# Altium project rsx_low_power_board.PrjPcb (part 1 of 2)
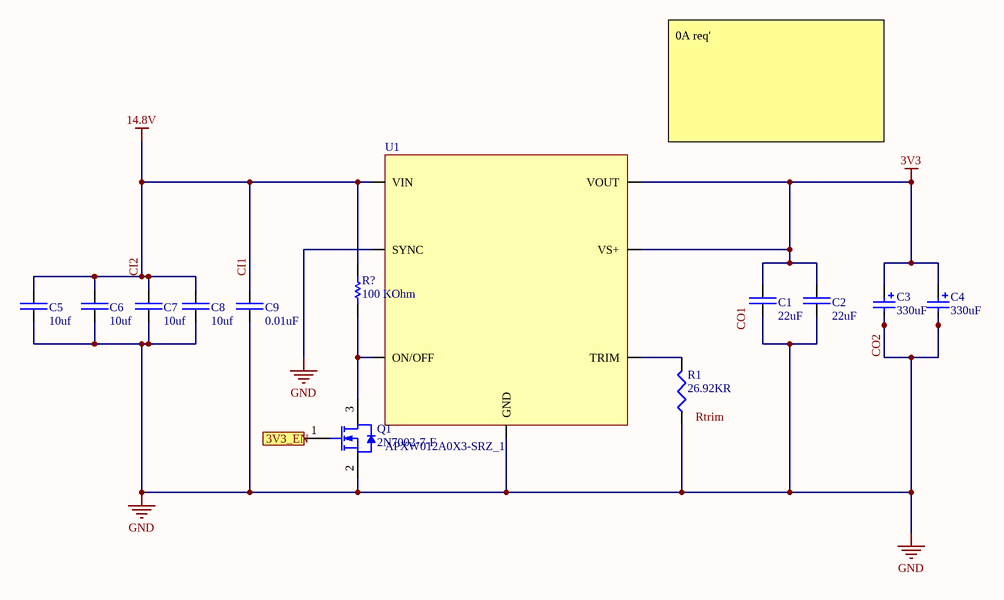
[diagram p0: rsx_low_power_board.SchDoc]
6 sheets, 69 parts. Net scope: flat (ports and power ports of the same name join across sheets).
Board file: rsx_low_power_board.PcbDoc
Sheets:
  rsx_low_power_board.SchDoc
  rsx_low_power_board_5V.SchDoc
  rsx_low_power_board_12V.SchDoc
  rsx_low_power_board_24V.SchDoc
  rsx_low_power_board In Going Connectors.SchDoc
  sch2_eFuse_5V.SchDoc

## Sheet rsx_low_power_board.SchDoc
size A4

### Parts
(Parts that share a designator on the sheet are numbered #1, #2 ... from top to bottom, then left to right.)
C1  22uF  [22uF Capacitor]
C2  22uF  [22uF Capacitor]
C3  330uF  [330uF throught hole]
C4  330uF  [330uF throught hole]
C5  10uf  [10uF capacitor LPB]
C6  10uf  [10uF capacitor LPB]
C7  10uf  [10uF capacitor LPB]
C8  10uf  [10uF capacitor LPB]
C9  0.01uF  [0.01uF capacitor]
Q1#1  2N7002-7-F  [DIOD-SOT23-3_V]
R1#1  26.92KR  [26.7KR Resistor]
R?#1  100 KOhm  [RESC1609X55X30ML10T20]
U1  APXW012A0X3-SRZ_1  [DC-DC Buck converter]

### Ports
3V3_EN (in)

### Nets
3V3: C1.2 C2.2 C3.1 C4.1 U1.3(VS+) U1.5(VOUT)
CI1: C5.2 C6.2 C7.2 C8.2 C9.2 R?#1.2 U1.7(VIN)  [also labelled 14.8V, CI2]
CO2: C1.1 C2.1 C3.2 C4.2 C5.1 C6.1 C7.1 C8.1 C9.1 Q1#1.2(S) R1#1.1 U1.2(GND) U1.6(SYNC)  [also labelled GND]
NetQ1#1_1: Q1#1.1(G) ; port 3V3_EN
NetQ1#1_3: Q1#1.3(D) R?#1.1 U1.1(ON/OFF)
NetR1#1_2: R1#1.2 U1.4(TRIM)

### Notes on the sheet
- 0A req'
- Labels drawn without touching a wire or pin: CO1, Rtrim

### Library data of the parts
C1 C2 = GRM32ER71E226KE15L: Cap Ceramic 22uF 25V X7R 10% SMD 1210 125C Embossed T/R; Manufacturer 1: Murata; Supplier 1: Digi-Key; Supplier Part Number 1: 490-5313-6-ND; Manufacturer Part Number 1: GRM32ER71E226KE15L; Stock 1: 52660; Pricing 1: 1=1,78000, 10=1,40600, 100=1,05410, 500=0,79646 (USD); RoHS: Yes; Mount: Surface Mount; Case/Package: 1210; Number of Pins: 2; Case Code (Metric): 3225; Case Code (Imperial): 1210; Material: Ceramic; Min Operating Temperature: -55°C; Max Operating Temperature: 125°C; Capacitance: 22uF; Tolerance: 10%; Dielectric: X7R; Voltage Rating: 25V; Packaging: Tape and Reel; Package Quantity: 1; Voltage Rating (DC): 25V; Termination: SMD/SMT; Voltage: 25V; Length: 3.2mm; Height: 2.5mm; Width: 0.098inch; Thickness: 0.106inch; Depth: 2.5mm; Radiation Hardening: No; REACH SVHC: No SVHC; Lead Free: Lead Free; ComponentLink1URL: https://datasheet.ciiva.com/6072/1697714-6072768.pdf?src-supplier=Farnell; ComponentLink1Description: https://datasheet.ciiva.com/6072/1697714-6072768.pdf?src-supplier=Farnell; ComponentLink2URL: https://datasheet.ciiva.com/16497/product-16497009.pdf?src-supplier=Future+Electronics; ComponentLink2Description: https://datasheet.ciiva.com/16497/product-16497009.pdf?src-supplier=Future+Electronics; ComponentLink3URL: https://datasheet.ciiva.com/3776/2741grm32er71e226ke1523-3776996.pdf?src-supplier=Arrow; ComponentLink3Description: https://datasheet.ciiva.com/3776/2741grm32er71e226ke1523-3776996.pdf?src-supplier=Arrow; ComponentLink4URL: https://datasheet.ciiva.com/11789/0900766b80ef921d-11789129.pdf?src-supplier=RSComponents; ComponentLink4Description: https://datasheet.ciiva.com/11789/0900766b80ef921d-11789129.pdf?src-supplier=RSComponents; ComponentLink5URL: https://datasheet.ciiva.com/29201/451826-da-01-de-vs-kondens-grm32-er71e-226ke15l-29201795.pdf?src-supplier=Conrad; ComponentLink5Description: https://datasheet.ciiva.com/29201/451826-da-01-de-vs-kondens-grm32-er71e-226ke15l-29201795.pdf?src-supplier=Conrad; ComponentLink6URL: https://datasheet.ciiva.com/175/partnumbering-e-01-175746.pdf?src-supplier=Digi-Key; ComponentLink6Description: https://datasheet.ciiva.com/175/partnumbering-e-01-175746.pdf?src-supplier=Digi-Key; ComponentLink7URL: https://datasheet.ciiva.com/175/partnumbering-e-01-175747.pdf?src-supplier=Digi-Key; ComponentLink7Description: https://datasheet.ciiva.com/175/partnumbering-e-01-175747.pdf?src-supplier=Digi-Key; ComponentLink8URL: https://datasheet.ciiva.com/175/partnumbering-e-01-175748.pdf?src-supplier=Digi-Key; ComponentLink8Description: https://datasheet.ciiva.com/175/partnumbering-e-01-175748.pdf?src-supplier=Digi-Key; ComponentLink9URL: https://datasheet.ciiva.com/22703/1697714-22703397.pdf?src-supplier=Element14; ComponentLink9Description: https://datasheet.ciiva.com/22703/1697714-22703397.pdf?src-supplier=Element14; Category: Capacitor
C3 C4 = 35ZLH330MEFCT810X12.5: CAP ALUM 330UF 20% 35V RADIAL; Manufacturer 1: Rubycon; Ripple Current: 731.5mA; Impedance: 39mR; Life (Hours): 10000Hour; Supplier 1: Digi-Key; Supplier Part Number 1: 1189-3752-1-ND; Manufacturer Part Number 1: 35ZLH330MEFCT810X12.5; Stock 1: 14330; Pricing 1: 1=0,52000, 10=0,36900, 100=0,24280 (USD); RoHS: Yes; Mount: Through Hole; Case/Package: Radial; Min Operating Temperature: -40°C; Max Operating Temperature: 105°C; Package Quantity: 1000; Capacitance: 330uF; Packaging: Tape and Reel; Tolerance: 20%; Voltage Rating: 35V; Lead Pitch: 0.197inch; Height - Seated (Max): 0.551inch; ComponentLink1URL: http://www.rubycon.co.jp/en/catalog/e_pdfs/aluminum/e_ZLH.pdf?src-supplier=Digi-Key; ComponentLink1Description: http://www.rubycon.co.jp/en/catalog/e_pdfs/aluminum/e_ZLH.pdf?src-supplier=Digi-Key; ComponentLink2URL: http://www.rubycon.co.jp/en/catalog/e_pdfs/aluminum/Radial_Lead_Alumi_Eng.pdf?src-supplier=Digi-Key; ComponentLink2Description: http://www.rubycon.co.jp/en/catalog/e_pdfs/aluminum/Radial_Lead_Alumi_Eng.pdf?src-supplier=Digi-Key
C5-C8 = GRT31CR61H106ME01L: CAP CER 10UF 50V X5R 1206; Manufacturer 1: Murata; Tolerance: 20%; Supplier 1: Digi-Key; Supplier Part Number 1: 490-12457-1-ND; Manufacturer Part Number 1: GRT31CR61H106ME01L; Stock 1: 8159; Pricing 1: 1=0,50000, 10=0,34900, 100=0,20920, 500=0,15690, 1000=0,13249 (USD); RoHS: Yes; Mount: Surface Mount; Case/Package: 1206; Case Code (Metric): 3216; Case Code (Imperial): 1206; Min Operating Temperature: -55°C; Max Operating Temperature: 85°C; Packaging: Tape and Reel; Capacitance: 10uF; Voltage Rating: 50V; Length: 0.126inch; Width: 0.063inch; Thickness: 0.071inch; Ratings: AEC-Q200; ComponentLink1URL: http://search.murata.co.jp/Ceramy/image/img/A01X/G101/ENG/GRT31CR61H106ME01-01.pdf?src-supplier=Digi-Key; ComponentLink1Description: http://search.murata.co.jp/Ceramy/image/img/A01X/G101/ENG/GRT31CR61H106ME01-01.pdf?src-supplier=Digi-Key; Category: Capacitor
C9 = C0603C103KARACAUTO: Cap Ceramic 0.01uF 250V X7R 10% Pad SMD 0603 125C Automotive T/R; Manufacturer 1: KEMET; Capacitance: 10nF; Supplier 1: Digi-Key; Supplier Part Number 1: 399-17960-1-ND; Manufacturer Part Number 1: C0603C103KARACAUTO; Stock 1: 8483; Pricing 1: 1=0,90000, 10=0,68500, 100=0,49040, 500=0,37964, 1000=0,32691 (USD); RoHS: No; Mount: Surface Mount; Case/Package: 0603; Case Code (Imperial): 0603; Case Code (Metric): 1608; Min Operating Temperature: -55°C; Max Operating Temperature: 125°C; Packaging: Tape and Reel; Tolerance: 10%; Voltage Rating: 250V; Ratings: AEC-Q200; ComponentLink1URL: https://api.kemet.com/component-edge/download/datasheet/C0603C103KARACAUTO.pdf?src-supplier=Digi-Key; ComponentLink1Description: https://api.kemet.com/component-edge/download/datasheet/C0603C103KARACAUTO.pdf?src-supplier=Digi-Key; Category: Capacitor
Q1#1 = CMP-2000-04929-1: N-Channel Enhancement Mode Field Effect Transistor, 60 V, 0.115 A, -55 to 150 degC, 3-Pin SOT23, RoHS, Tape and Reel; Id - Continuous Drain Current: 115mA; Typical Turn-On Delay Time: 7ns; Typical Turn-Off Delay Time: 11ns; Brand: DiodesIncorporated; Transistor Type: 1N-Channel; Vgs - Gate-Source Voltage: 20V; Rise Time: 3ns; Configuration: Single; Fall Time: 5.6ns; Vds - Drain-Source Breakdown Voltage: 70V; Rds On - Drain-Source Resistance: 7.5Ohms; Number of Channels: 1Channel; Forward Transconductance - Min: 0.08S; Pd - Power Dissipation: 300mW; Unit Weight: 0.000282oz; Datasheet URL: http://datasheet.octopart.com/2N7002-7-F-Diodes-Inc.-datasheet-8326113.pdf; Width: 1.3mm; Series: 2N7002; Length: 2.9mm; Product Category: MOSFET; Minimum Operating Temperature: -55C; Manufacturer URL: http://www.diodes.com/; Mounting Style: SMD/SMT; Package Reference: SOT23-3; Package Description: 3-Pin Small Outline Transistor, Body 2.9 x 1.3 mm, Pitch 0.96 mm; Maximum Operating Temperature: +150C; Transistor Polarity: N-Channel; Factory Pack Quantity: 3000; Technology: Si; Channel Mode: Enhancement; Datasheet Version: Rev. 21-2, 02/2009; Type: EnhancementModeFieldEffectTransistor; RoHS: True; Packaging: Reel; Package / Case: SOT-23-3; Height: 1mm; Product: MOSFETSmallSignal; Manufacturer: DiodesIncorporated
R1#1 = ERA-3AEB2672V: RES SMD 26.7KOHM 0.1% 1/10W 0603; Manufacturer 1: Panasonic; Resistance: 26.7kR; Power Rating: 100mW; Voltage Rating: 75V; Temperature Coefficient: 25ppm/°C; Supplier 1: Digi-Key; Supplier Part Number 1: P26.7KDBCT-ND; Manufacturer Part Number 1: ERA-3AEB2672V; Stock 1: 17260; Pricing 1: 1=0,35000, 10=0,30000, 100=0,11720, 1000=0,04906, 2500=0,04498 (USD); RoHS: Yes; Mount: Surface Mount; Case/Package: 0603; Number of Pins: 2; Case Code (Metric): 1608; Case Code (Imperial): 0603; Contact Plating: Tin; Min Operating Temperature: -55°C; Max Operating Temperature: 155°C; Tolerance: 0.1%; Packaging: Tape and Reel; Package Quantity: 1; Composition: Thin Film,Metal Film; Number of Terminations: 2; Max Power Dissipation: 100mW; Voltage Rating (DC): 75V; Features: Automotive AEC-Q200; Length: 1.6mm; Height: 0.45mm; Width: 0.8mm; Depth: 0.8mm; Radiation Hardening: No; Lead Free: Lead Free; REACH SVHC: No SVHC; ComponentLink1URL: https://datasheet.ciiva.com/11814/0900766b80eb1d8c-11814836.pdf?src-supplier=RSComponents; ComponentLink1Description: https://datasheet.ciiva.com/11814/0900766b80eb1d8c-11814836.pdf?src-supplier=RSComponents; ComponentLink2URL: https://datasheet.ciiva.com/5987/485442-5987192.pdf?src-supplier=Farnell; ComponentLink2Description: https://datasheet.ciiva.com/5987/485442-5987192.pdf?src-supplier=Farnell; ComponentLink3URL: https://datasheet.ciiva.com/5987/485442-5987183.pdf?src-supplier=Farnell; ComponentLink3Description: https://datasheet.ciiva.com/5987/485442-5987183.pdf?src-supplier=Farnell; ComponentLink4URL: https://datasheet.ciiva.com/46422/485442-46422629.pdf?src-supplier=Element14; ComponentLink4Description: https://datasheet.ciiva.com/46422/485442-46422629.pdf?src-supplier=Element14; ComponentLink5URL: https://datasheet.ciiva.com/17210/aoa0000ce26-17210681.pdf?src-supplier=Avnet+Europe; ComponentLink5Description: https://datasheet.ciiva.com/17210/aoa0000ce26-17210681.pdf?src-supplier=Avnet+Europe
R?#1 = CMP-2000-03816-1: Part Number: CRCW06030000Z0EA; Manufacturer: Vishay Dale
U1 = APXW012A0X3-SRZ_1: DC DC CONVERTER 3-18V 12A; Manufacturer 1: GE; Number of Outputs: 1; Min Input Voltage: 9V; Max Input Voltage: 36V; Voltage - Output 1: 18V; Efficiency: 95.5%; Supplier 1: Avnet; Supplier Part Number 1: 150028492; Manufacturer Part Number 1: APXW012A0X3-SRZ; Stock 1: 0; RoHS: Yes; Mount: Surface Mount; Case/Package: Module; Number of Pins: 9; Min Operating Temperature: -40°C; Max Operating Temperature: 85°C; Packaging: Tape and Reel; Max Output Current: 12A; Current - Output 1: 12A; Package Quantity: 140; Output Current: 12A; Output Voltage: 18V; Features: OCP,OTP; Length: 1.3inch; Height: 0.39inch; Width: 0.53inch; ComponentLink1URL: http://apps.geindustrial.com/publibrary/checkout/DS-APXW012?TNR=Data%20Sheets&src-supplier=Avnet; ComponentLink1Description: http://apps.geindustrial.com/publibrary/checkout/DS-APXW012?TNR=Data%20Sheets&src-supplier=Avnet; ComponentLink2URL: http://apps.geindustrial.com/publibrary/checkout/DS-APXW012?TNR=Data%20Sheets|DS-APXW012|generic&src-supplier=Digi-Key; ComponentLink2Description: http://apps.geindustrial.com/publibrary/checkout/DS-APXW012?TNR=Data%20Sheets|DS-APXW012|generic&src-supplier=Digi-Key; ComponentLink3URL: http://apps.geindustrial.com/publibrary/checkout/DS-APXW012?TNR=Data%20Sheets%7CDS-APXW012%7Cgeneric&src-supplier=Mouser; ComponentLink3Description: http://apps.geindustrial.com/publibrary/checkout/DS-APXW012?TNR=Data%20Sheets%7CDS-APXW012%7Cgeneric&src-supplier=Mouser; Category: Buck Converter

## Sheet rsx_low_power_board_5V.SchDoc
size A4
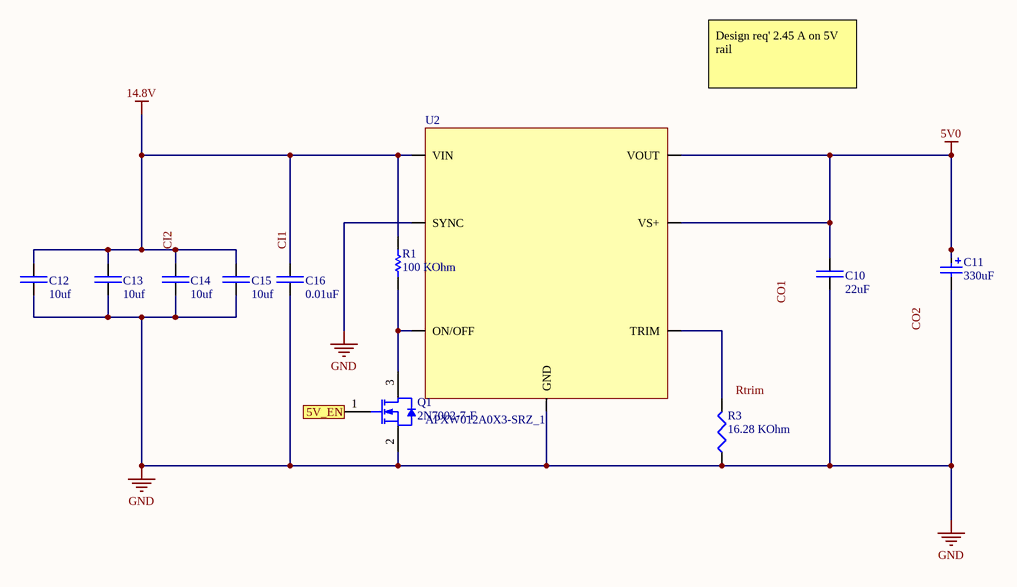
[diagram p1: rsx_low_power_board_5V.SchDoc]

### Parts
(Parts that share a designator on the sheet are numbered #1, #2 ... from top to bottom, then left to right.)
C10  22uF  [22uF Capacitor]
C11  330uF  [330uF throught hole]
C12  10uf  [10uF capacitor LPB]
C13  10uf  [10uF capacitor LPB]
C14  10uf  [10uF capacitor LPB]
C15  10uf  [10uF capacitor LPB]
C16  0.01uF  [0.01uF capacitor]
Q1#2  2N7002-7-F  [DIOD-SOT23-3_V]
R1#2  100 KOhm  [RESC1609X55X30ML10T20]
R3#1  16.28 KOhm  [16.2 KOhm Resistor]
U2  APXW012A0X3-SRZ_1  [DC-DC Buck converter]

### Ports
5V_EN (in)

### Nets
5V0: C10.2 C11.1 U2.3(VS+) U2.5(VOUT)
CI1: C12.2 C13.2 C14.2 C15.2 C16.2 R1#2.2 U2.7(VIN)  [also labelled 14.8V, CI2]
GND: C10.1 C11.2 C12.1 C13.1 C14.1 C15.1 C16.1 Q1#2.2(S) R3#1.1 U2.2(GND) U2.6(SYNC)  [project net CO2]
NetQ1#2_1: Q1#2.1(G) ; port 5V_EN
NetQ1#2_3: Q1#2.3(D) R1#2.1 U2.1(ON/OFF)
NetR3#1_2: R3#1.2 U2.4(TRIM)

### Notes on the sheet
- Design req' 2.45 A on 5V rail
- Labels drawn without touching a wire or pin: CO1, CO2, Rtrim

### Library data of the parts
C10 = GRM32ER71E226KE15L: as C1 on sheet rsx_low_power_board; Supplier 1: Digi-Key; Supplier Part Number 1: 490-5313-6-ND; Manufacturer Part Number 1: GRM32ER71E226KE15L; Stock 1: 52660; Pricing 1: 1=1,78000, 10=1,40600, 100=1,05410, 500=0,79646 (USD); RoHS: Yes; Mount: Surface Mount; Case/Package: 1210; Number of Pins: 2; Case Code (Metric): 3225; Case Code (Imperial): 1210; Material: Ceramic; Min Operating Temperature: -55°C; Max Operating Temperature: 125°C; Capacitance: 22uF; Tolerance: 10%; Dielectric: X7R; Voltage Rating: 25V; Packaging: Tape and Reel; Package Quantity: 1; Voltage Rating (DC): 25V; Termination: SMD/SMT; Voltage: 25V; Length: 3.2mm; Height: 2.5mm; Width: 0.098inch; Thickness: 0.106inch; Depth: 2.5mm; Radiation Hardening: No; REACH SVHC: No SVHC; Lead Free: Lead Free; ComponentLink1URL: https://datasheet.ciiva.com/6072/1697714-6072768.pdf?src-supplier=Farnell; ComponentLink1Description: https://datasheet.ciiva.com/6072/1697714-6072768.pdf?src-supplier=Farnell; ComponentLink2URL: https://datasheet.ciiva.com/16497/product-16497009.pdf?src-supplier=Future+Electronics; ComponentLink2Description: https://datasheet.ciiva.com/16497/product-16497009.pdf?src-supplier=Future+Electronics; ComponentLink3URL: https://datasheet.ciiva.com/3776/2741grm32er71e226ke1523-3776996.pdf?src-supplier=Arrow; ComponentLink3Description: https://datasheet.ciiva.com/3776/2741grm32er71e226ke1523-3776996.pdf?src-supplier=Arrow; ComponentLink4URL: https://datasheet.ciiva.com/11789/0900766b80ef921d-11789129.pdf?src-supplier=RSComponents; ComponentLink4Description: https://datasheet.ciiva.com/11789/0900766b80ef921d-11789129.pdf?src-supplier=RSComponents; ComponentLink5URL: https://datasheet.ciiva.com/29201/451826-da-01-de-vs-kondens-grm32-er71e-226ke15l-29201795.pdf?src-supplier=Conrad; ComponentLink5Description: https://datasheet.ciiva.com/29201/451826-da-01-de-vs-kondens-grm32-er71e-226ke15l-29201795.pdf?src-supplier=Conrad; ComponentLink6URL: https://datasheet.ciiva.com/175/partnumbering-e-01-175746.pdf?src-supplier=Digi-Key; ComponentLink6Description: https://datasheet.ciiva.com/175/partnumbering-e-01-175746.pdf?src-supplier=Digi-Key; ComponentLink7URL: https://datasheet.ciiva.com/175/partnumbering-e-01-175747.pdf?src-supplier=Digi-Key; ComponentLink7Description: https://datasheet.ciiva.com/175/partnumbering-e-01-175747.pdf?src-supplier=Digi-Key; ComponentLink8URL: https://datasheet.ciiva.com/175/partnumbering-e-01-175748.pdf?src-supplier=Digi-Key; ComponentLink8Description: https://datasheet.ciiva.com/175/partnumbering-e-01-175748.pdf?src-supplier=Digi-Key; ComponentLink9URL: https://datasheet.ciiva.com/22703/1697714-22703397.pdf?src-supplier=Element14; ComponentLink9Description: https://datasheet.ciiva.com/22703/1697714-22703397.pdf?src-supplier=Element14; Category: Capacitor
C11 = 35ZLH330MEFCT810X12.5: as C3 on sheet rsx_low_power_board; Supplier 1: Digi-Key; Supplier Part Number 1: 1189-3752-1-ND; Manufacturer Part Number 1: 35ZLH330MEFCT810X12.5; Stock 1: 14330; Pricing 1: 1=0,52000, 10=0,36900, 100=0,24280 (USD); RoHS: Yes; Mount: Through Hole; Case/Package: Radial; Min Operating Temperature: -40°C; Max Operating Temperature: 105°C; Package Quantity: 1000; Capacitance: 330uF; Packaging: Tape and Reel; Tolerance: 20%; Voltage Rating: 35V; Lead Pitch: 0.197inch; Height - Seated (Max): 0.551inch; ComponentLink1URL: http://www.rubycon.co.jp/en/catalog/e_pdfs/aluminum/e_ZLH.pdf?src-supplier=Digi-Key; ComponentLink1Description: http://www.rubycon.co.jp/en/catalog/e_pdfs/aluminum/e_ZLH.pdf?src-supplier=Digi-Key; ComponentLink2URL: http://www.rubycon.co.jp/en/catalog/e_pdfs/aluminum/Radial_Lead_Alumi_Eng.pdf?src-supplier=Digi-Key; ComponentLink2Description: http://www.rubycon.co.jp/en/catalog/e_pdfs/aluminum/Radial_Lead_Alumi_Eng.pdf?src-supplier=Digi-Key
C12-C15 = GRT31CR61H106ME01L: as C5 on sheet rsx_low_power_board; Supplier 1: Digi-Key; Supplier Part Number 1: 490-12457-1-ND; Manufacturer Part Number 1: GRT31CR61H106ME01L; Stock 1: 8159; Pricing 1: 1=0,50000, 10=0,34900, 100=0,20920, 500=0,15690, 1000=0,13249 (USD); RoHS: Yes; Mount: Surface Mount; Case/Package: 1206; Case Code (Metric): 3216; Case Code (Imperial): 1206; Min Operating Temperature: -55°C; Max Operating Temperature: 85°C; Packaging: Tape and Reel; Capacitance: 10uF; Voltage Rating: 50V; Length: 0.126inch; Width: 0.063inch; Thickness: 0.071inch; Ratings: AEC-Q200; ComponentLink1URL: http://search.murata.co.jp/Ceramy/image/img/A01X/G101/ENG/GRT31CR61H106ME01-01.pdf?src-supplier=Digi-Key; ComponentLink1Description: http://search.murata.co.jp/Ceramy/image/img/A01X/G101/ENG/GRT31CR61H106ME01-01.pdf?src-supplier=Digi-Key; Category: Capacitor
C16 = C0603C103KARACAUTO: as C9 on sheet rsx_low_power_board; Supplier 1: Digi-Key; Supplier Part Number 1: 399-17960-1-ND; Manufacturer Part Number 1: C0603C103KARACAUTO; Stock 1: 8483; Pricing 1: 1=0,90000, 10=0,68500, 100=0,49040, 500=0,37964, 1000=0,32691 (USD); RoHS: No; Mount: Surface Mount; Case/Package: 0603; Case Code (Imperial): 0603; Case Code (Metric): 1608; Min Operating Temperature: -55°C; Max Operating Temperature: 125°C; Packaging: Tape and Reel; Tolerance: 10%; Voltage Rating: 250V; Ratings: AEC-Q200; ComponentLink1URL: https://api.kemet.com/component-edge/download/datasheet/C0603C103KARACAUTO.pdf?src-supplier=Digi-Key; ComponentLink1Description: https://api.kemet.com/component-edge/download/datasheet/C0603C103KARACAUTO.pdf?src-supplier=Digi-Key; Category: Capacitor
Q1#2 = CMP-2000-04929-1: as Q1#1 on sheet rsx_low_power_board; Datasheet URL: http://datasheet.octopart.com/2N7002-7-F-Diodes-Inc.-datasheet-8326113.pdf; Width: 1.3mm; Series: 2N7002; Length: 2.9mm; Product Category: MOSFET; Minimum Operating Temperature: -55C; Manufacturer URL: http://www.diodes.com/; Mounting Style: SMD/SMT; Package Reference: SOT23-3; Package Description: 3-Pin Small Outline Transistor, Body 2.9 x 1.3 mm, Pitch 0.96 mm; Maximum Operating Temperature: +150C; Transistor Polarity: N-Channel; Factory Pack Quantity: 3000; Technology: Si; Channel Mode: Enhancement; Datasheet Version: Rev. 21-2, 02/2009; Type: EnhancementModeFieldEffectTransistor; RoHS: True; Packaging: Reel; Package / Case: SOT-23-3; Height: 1mm; Product: MOSFETSmallSignal; Manufacturer: DiodesIncorporated
R1#2 = CMP-2000-03816-1: as R?#1 on sheet rsx_low_power_board
R3#1 = RT0603DRD0716K2L: RES SMD 16.2KOHM 0.5% 1/10W 0603; Manufacturer 1: Yageo; Resistance: 16.2kR; Max Power Dissipation: 100mW; Temperature Coefficient: 25ppm/°C; Voltage Rating (DC): 50V; Supplier 1: Digi-Key; Supplier Part Number 1: 311-16.2KDCT-ND; Manufacturer Part Number 1: RT0603DRD0716K2L; Stock 1: 8163; Pricing 1: 1=0,20000, 10=0,16800, 100=0,06570, 1000=0,02750, 2500=0,02521 (USD); RoHS: Yes; Case/Package: 0603; Case Code (Metric): 1608; Case Code (Imperial): 0603; Min Operating Temperature: -55°C; Max Operating Temperature: 155°C; Package Quantity: 1; Tolerance: 0.5%; Packaging: Tape and Reel; Composition: Thin Film; Number of Terminations: 2; Features: Moisture Resistant; Length: 0.063inch; Height: 0.022inch; Width: 0.031inch; Lead Free: Lead Free; ComponentLink1URL: http://www.yageo.com/documents/recent/PYu-RT_1-to-0.01_RoHS_L_8.pdf?src-supplier=Digi-Key; ComponentLink1Description: http://www.yageo.com/documents/recent/PYu-RT_1-to-0.01_RoHS_L_8.pdf?src-supplier=Digi-Key; Category: Resistors
U2 = APXW012A0X3-SRZ_1: as U1 on sheet rsx_low_power_board; Supplier 1: Avnet; Supplier Part Number 1: 150028492; Manufacturer Part Number 1: APXW012A0X3-SRZ; Stock 1: 0; RoHS: Yes; Mount: Surface Mount; Case/Package: Module; Number of Pins: 9; Min Operating Temperature: -40°C; Max Operating Temperature: 85°C; Packaging: Tape and Reel; Max Output Current: 12A; Current - Output 1: 12A; Package Quantity: 140; Output Current: 12A; Output Voltage: 18V; Features: OCP,OTP; Length: 1.3inch; Height: 0.39inch; Width: 0.53inch; ComponentLink1URL: http://apps.geindustrial.com/publibrary/checkout/DS-APXW012?TNR=Data%20Sheets&src-supplier=Avnet; ComponentLink1Description: http://apps.geindustrial.com/publibrary/checkout/DS-APXW012?TNR=Data%20Sheets&src-supplier=Avnet; ComponentLink2URL: http://apps.geindustrial.com/publibrary/checkout/DS-APXW012?TNR=Data%20Sheets|DS-APXW012|generic&src-supplier=Digi-Key; ComponentLink2Description: http://apps.geindustrial.com/publibrary/checkout/DS-APXW012?TNR=Data%20Sheets|DS-APXW012|generic&src-supplier=Digi-Key; ComponentLink3URL: http://apps.geindustrial.com/publibrary/checkout/DS-APXW012?TNR=Data%20Sheets%7CDS-APXW012%7Cgeneric&src-supplier=Mouser; ComponentLink3Description: http://apps.geindustrial.com/publibrary/checkout/DS-APXW012?TNR=Data%20Sheets%7CDS-APXW012%7Cgeneric&src-supplier=Mouser; Category: Buck Converter

## Sheet rsx_low_power_board_12V.SchDoc
size A4
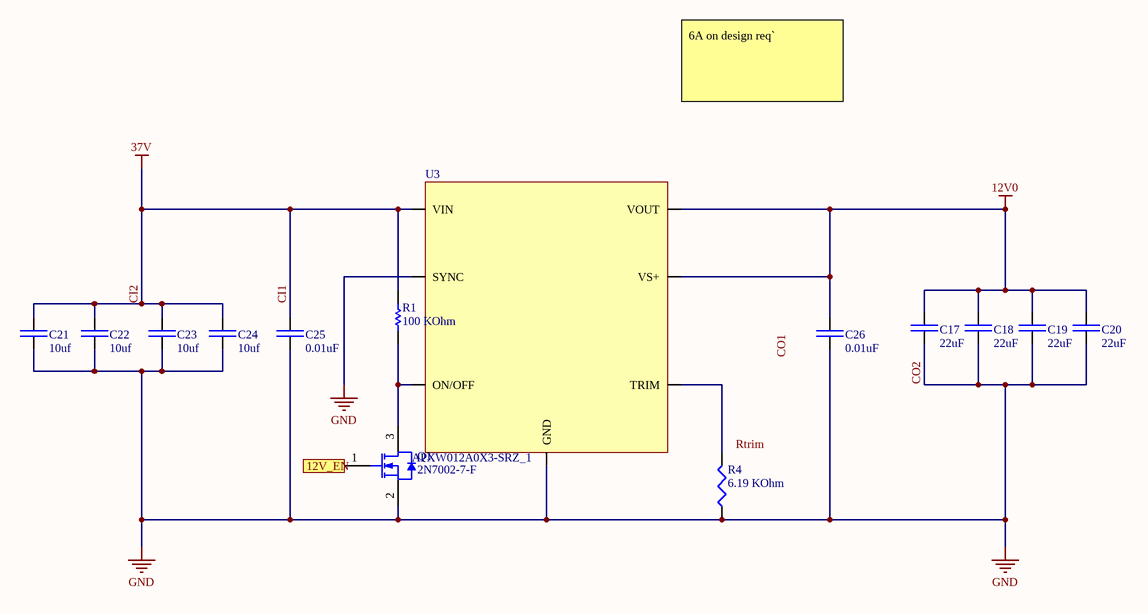
[diagram p2: rsx_low_power_board_12V.SchDoc]

### Parts
(Parts that share a designator on the sheet are numbered #1, #2 ... from top to bottom, then left to right.)
C17  22uF  [22uF Capacitor]
C18  22uF  [22uF Capacitor]
C19  22uF  [22uF Capacitor]
C20  22uF  [22uF Capacitor]
C21  10uf  [10uF capacitor LPB]
C22  10uf  [10uF capacitor LPB]
C23  10uf  [10uF capacitor LPB]
C24  10uf  [10uF capacitor LPB]
C25  0.01uF  [0.01uF capacitor]
C26  0.01uF  [0.01uF capacitor]
Q1#3  2N7002-7-F  [DIOD-SOT23-3_V]
R1#3  100 KOhm  [RESC1609X55X30ML10T20]
R4  6.19 KOhm  [6.19KOhm Resistor]
U3  APXW012A0X3-SRZ_1  [DC-DC Buck converter]

### Ports
12V_EN (in)

### Nets
12V0: C17.2 C18.2 C19.2 C20.2 C26.2 U3.3(VS+) U3.5(VOUT)
CI1: C21.2 C22.2 C23.2 C24.2 C25.2 R1#3.2 U3.7(VIN)  [also labelled 37V, CI2]
CO2: C17.1 C18.1 C19.1 C20.1 C21.1 C22.1 C23.1 C24.1 C25.1 C26.1 Q1#3.2(S) R4.1 U3.2(GND) U3.6(SYNC)  [also labelled GND]
NetQ1#3_1: Q1#3.1(G) ; port 12V_EN
NetQ1#3_3: Q1#3.3(D) R1#3.1 U3.1(ON/OFF)
NetR4_2: R4.2 U3.4(TRIM)

### Notes on the sheet
- 6A on design req`
- Labels drawn without touching a wire or pin: CO1, Rtrim

### Library data of the parts
C17-C20 = GRM32ER71E226KE15L: as C1 on sheet rsx_low_power_board; Supplier 1: Digi-Key; Supplier Part Number 1: 490-5313-6-ND; Manufacturer Part Number 1: GRM32ER71E226KE15L; Stock 1: 52660; Pricing 1: 1=1,78000, 10=1,40600, 100=1,05410, 500=0,79646 (USD); RoHS: Yes; Mount: Surface Mount; Case/Package: 1210; Number of Pins: 2; Case Code (Metric): 3225; Case Code (Imperial): 1210; Material: Ceramic; Min Operating Temperature: -55°C; Max Operating Temperature: 125°C; Capacitance: 22uF; Tolerance: 10%; Dielectric: X7R; Voltage Rating: 25V; Packaging: Tape and Reel; Package Quantity: 1; Voltage Rating (DC): 25V; Termination: SMD/SMT; Voltage: 25V; Length: 3.2mm; Height: 2.5mm; Width: 0.098inch; Thickness: 0.106inch; Depth: 2.5mm; Radiation Hardening: No; REACH SVHC: No SVHC; Lead Free: Lead Free; ComponentLink1URL: https://datasheet.ciiva.com/6072/1697714-6072768.pdf?src-supplier=Farnell; ComponentLink1Description: https://datasheet.ciiva.com/6072/1697714-6072768.pdf?src-supplier=Farnell; ComponentLink2URL: https://datasheet.ciiva.com/16497/product-16497009.pdf?src-supplier=Future+Electronics; ComponentLink2Description: https://datasheet.ciiva.com/16497/product-16497009.pdf?src-supplier=Future+Electronics; ComponentLink3URL: https://datasheet.ciiva.com/3776/2741grm32er71e226ke1523-3776996.pdf?src-supplier=Arrow; ComponentLink3Description: https://datasheet.ciiva.com/3776/2741grm32er71e226ke1523-3776996.pdf?src-supplier=Arrow; ComponentLink4URL: https://datasheet.ciiva.com/11789/0900766b80ef921d-11789129.pdf?src-supplier=RSComponents; ComponentLink4Description: https://datasheet.ciiva.com/11789/0900766b80ef921d-11789129.pdf?src-supplier=RSComponents; ComponentLink5URL: https://datasheet.ciiva.com/29201/451826-da-01-de-vs-kondens-grm32-er71e-226ke15l-29201795.pdf?src-supplier=Conrad; ComponentLink5Description: https://datasheet.ciiva.com/29201/451826-da-01-de-vs-kondens-grm32-er71e-226ke15l-29201795.pdf?src-supplier=Conrad; ComponentLink6URL: https://datasheet.ciiva.com/175/partnumbering-e-01-175746.pdf?src-supplier=Digi-Key; ComponentLink6Description: https://datasheet.ciiva.com/175/partnumbering-e-01-175746.pdf?src-supplier=Digi-Key; ComponentLink7URL: https://datasheet.ciiva.com/175/partnumbering-e-01-175747.pdf?src-supplier=Digi-Key; ComponentLink7Description: https://datasheet.ciiva.com/175/partnumbering-e-01-175747.pdf?src-supplier=Digi-Key; ComponentLink8URL: https://datasheet.ciiva.com/175/partnumbering-e-01-175748.pdf?src-supplier=Digi-Key; ComponentLink8Description: https://datasheet.ciiva.com/175/partnumbering-e-01-175748.pdf?src-supplier=Digi-Key; ComponentLink9URL: https://datasheet.ciiva.com/22703/1697714-22703397.pdf?src-supplier=Element14; ComponentLink9Description: https://datasheet.ciiva.com/22703/1697714-22703397.pdf?src-supplier=Element14; Category: Capacitor
C21-C24 = GRT31CR61H106ME01L: as C5 on sheet rsx_low_power_board; Supplier 1: Digi-Key; Supplier Part Number 1: 490-12457-1-ND; Manufacturer Part Number 1: GRT31CR61H106ME01L; Stock 1: 8159; Pricing 1: 1=0,50000, 10=0,34900, 100=0,20920, 500=0,15690, 1000=0,13249 (USD); RoHS: Yes; Mount: Surface Mount; Case/Package: 1206; Case Code (Metric): 3216; Case Code (Imperial): 1206; Min Operating Temperature: -55°C; Max Operating Temperature: 85°C; Packaging: Tape and Reel; Capacitance: 10uF; Voltage Rating: 50V; Length: 0.126inch; Width: 0.063inch; Thickness: 0.071inch; Ratings: AEC-Q200; ComponentLink1URL: http://search.murata.co.jp/Ceramy/image/img/A01X/G101/ENG/GRT31CR61H106ME01-01.pdf?src-supplier=Digi-Key; ComponentLink1Description: http://search.murata.co.jp/Ceramy/image/img/A01X/G101/ENG/GRT31CR61H106ME01-01.pdf?src-supplier=Digi-Key; Category: Capacitor
C25 C26 = C0603C103KARACAUTO: as C9 on sheet rsx_low_power_board; Supplier 1: Digi-Key; Supplier Part Number 1: 399-17960-1-ND; Manufacturer Part Number 1: C0603C103KARACAUTO; Stock 1: 8483; Pricing 1: 1=0,90000, 10=0,68500, 100=0,49040, 500=0,37964, 1000=0,32691 (USD); RoHS: No; Mount: Surface Mount; Case/Package: 0603; Case Code (Imperial): 0603; Case Code (Metric): 1608; Min Operating Temperature: -55°C; Max Operating Temperature: 125°C; Packaging: Tape and Reel; Tolerance: 10%; Voltage Rating: 250V; Ratings: AEC-Q200; ComponentLink1URL: https://api.kemet.com/component-edge/download/datasheet/C0603C103KARACAUTO.pdf?src-supplier=Digi-Key; ComponentLink1Description: https://api.kemet.com/component-edge/download/datasheet/C0603C103KARACAUTO.pdf?src-supplier=Digi-Key; Category: Capacitor
Q1#3 = CMP-2000-04929-1: as Q1#1 on sheet rsx_low_power_board; Datasheet URL: http://datasheet.octopart.com/2N7002-7-F-Diodes-Inc.-datasheet-8326113.pdf; Width: 1.3mm; Series: 2N7002; Length: 2.9mm; Product Category: MOSFET; Minimum Operating Temperature: -55C; Manufacturer URL: http://www.diodes.com/; Mounting Style: SMD/SMT; Package Reference: SOT23-3; Package Description: 3-Pin Small Outline Transistor, Body 2.9 x 1.3 mm, Pitch 0.96 mm; Maximum Operating Temperature: +150C; Transistor Polarity: N-Channel; Factory Pack Quantity: 3000; Technology: Si; Channel Mode: Enhancement; Datasheet Version: Rev. 21-2, 02/2009; Type: EnhancementModeFieldEffectTransistor; RoHS: True; Packaging: Reel; Package / Case: SOT-23-3; Height: 1mm; Product: MOSFETSmallSignal; Manufacturer: DiodesIncorporated
R1#3 = CMP-2000-03816-1: as R?#1 on sheet rsx_low_power_board
R4 = ERA3AEB6191V: RES SMD 6.19KOHM 0.1% 1/10W 0603; Manufacturer 1: Panasonic; Resistance: 6.19kR; Power Rating: 100mW; Voltage Rating: 75V; Temperature Coefficient: 25ppm/°C; Supplier 1: Digi-Key; Supplier Part Number 1: P6.19KDBCT-ND; Manufacturer Part Number 1: ERA3AEB6191V; Stock 1: 26110; Pricing 1: 1=0,35000, 10=0,30000, 100=0,11720, 1000=0,04906, 2500=0,04498 (USD); RoHS: Yes; Mount: Surface Mount; Case/Package: 0603; Number of Pins: 2; Case Code (Imperial): 0603; Case Code (Metric): 1608; Contact Plating: Tin; Min Operating Temperature: -55°C; Max Operating Temperature: 155°C; Tolerance: 0.1%; Packaging: Tape and Reel; Package Quantity: 1; Composition: Metal Film,Thin Film; Number of Terminations: 2; Military Standard: Not; Max Power Dissipation: 100mW; Voltage Rating (DC): 75V; Features: Automotive AEC-Q200; Length: 1.6mm; Height: 0.45mm; Width: 0.8mm; Depth: 0.8mm; Radiation Hardening: No; REACH SVHC: No SVHC; Lead Free: Lead Free; ComponentLink1URL: https://datasheet.ciiva.com/11809/0900766b80eb1d8c-11809038.pdf?src-supplier=RSComponents; ComponentLink1Description: https://datasheet.ciiva.com/11809/0900766b80eb1d8c-11809038.pdf?src-supplier=RSComponents; ComponentLink2URL: https://datasheet.ciiva.com/5971/485442-5971798.pdf?src-supplier=Farnell; ComponentLink2Description: https://datasheet.ciiva.com/5971/485442-5971798.pdf?src-supplier=Farnell; ComponentLink3URL: https://datasheet.ciiva.com/24026/aoa0000ce26-32660-24026983.pdf?src-supplier=Mouser; ComponentLink3Description: https://datasheet.ciiva.com/24026/aoa0000ce26-32660-24026983.pdf?src-supplier=Mouser; ComponentLink4URL: https://datasheet.ciiva.com/46447/485442-46447114.pdf?src-supplier=Element14; ComponentLink4Description: https://datasheet.ciiva.com/46447/485442-46447114.pdf?src-supplier=Element14; ComponentLink5URL: https://datasheet.ciiva.com/43457/485442-43457243.pdf?src-supplier=Farnell; ComponentLink5Description: https://datasheet.ciiva.com/43457/485442-43457243.pdf?src-supplier=Farnell; ComponentLink6URL: https://datasheet.ciiva.com/46447/485442-46447115.pdf?src-supplier=Element14; ComponentLink6Description: https://datasheet.ciiva.com/46447/485442-46447115.pdf?src-supplier=Element14; ComponentLink7URL: https://datasheet.ciiva.com/41450/001180853-da-01-en-widerstand-era-0603-6k19-0-1-5000st-41450170.pdf?src-supplier=Conrad; ComponentLink7Description: https://datasheet.ciiva.com/41450/001180853-da-01-en-widerstand-era-0603-6k19-0-1-5000st-41450170.pdf?src-supplier=Conrad
U3 = APXW012A0X3-SRZ_1: as U1 on sheet rsx_low_power_board; Supplier 1: Avnet; Supplier Part Number 1: 150028492; Manufacturer Part Number 1: APXW012A0X3-SRZ; Stock 1: 0; RoHS: Yes; Mount: Surface Mount; Case/Package: Module; Number of Pins: 9; Min Operating Temperature: -40°C; Max Operating Temperature: 85°C; Packaging: Tape and Reel; Max Output Current: 12A; Current - Output 1: 12A; Package Quantity: 140; Output Current: 12A; Output Voltage: 18V; Features: OCP,OTP; Length: 1.3inch; Height: 0.39inch; Width: 0.53inch; ComponentLink1URL: http://apps.geindustrial.com/publibrary/checkout/DS-APXW012?TNR=Data%20Sheets&src-supplier=Avnet; ComponentLink1Description: http://apps.geindustrial.com/publibrary/checkout/DS-APXW012?TNR=Data%20Sheets&src-supplier=Avnet; ComponentLink2URL: http://apps.geindustrial.com/publibrary/checkout/DS-APXW012?TNR=Data%20Sheets|DS-APXW012|generic&src-supplier=Digi-Key; ComponentLink2Description: http://apps.geindustrial.com/publibrary/checkout/DS-APXW012?TNR=Data%20Sheets|DS-APXW012|generic&src-supplier=Digi-Key; ComponentLink3URL: http://apps.geindustrial.com/publibrary/checkout/DS-APXW012?TNR=Data%20Sheets%7CDS-APXW012%7Cgeneric&src-supplier=Mouser; ComponentLink3Description: http://apps.geindustrial.com/publibrary/checkout/DS-APXW012?TNR=Data%20Sheets%7CDS-APXW012%7Cgeneric&src-supplier=Mouser; Category: Buck Converter

## Sheet rsx_low_power_board_24V.SchDoc
size A4
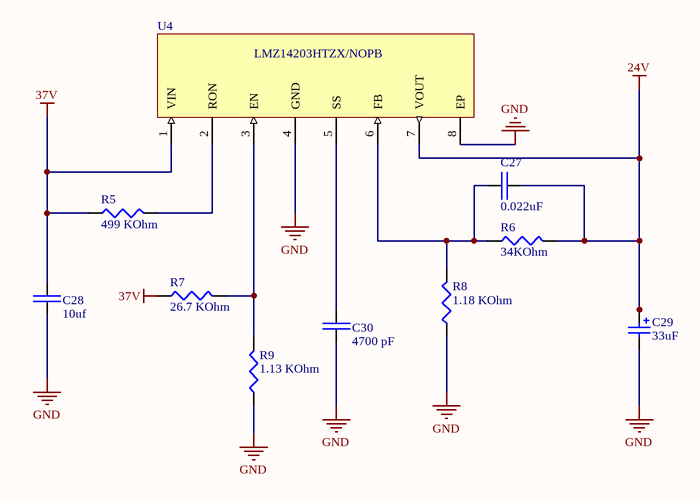
[diagram p3: rsx_low_power_board_24V.SchDoc]

### Parts
C27  0.022uF  [0.022uF Ceramic]
C28  10uf  [10uF capacitor LPB]
C29  33uF  [33uF Through hole Radical]
C30  4700 pF  [4700uF 0805]
R5  499 KOhm  [499KOhm RG2012]
R6  34KOhm  [34 KOhm Resistor ERA-6A]
R7  26.7 KOhm  [34 KOhm Resistor ERA-6A]
R8  1.18 KOhm  [34 KOhm Resistor ERA-6A]
R9  1.13 KOhm  [34 KOhm Resistor ERA-6A]
U4  LMZ14203HTZX/NOPB  [24V DC to DC buck]

### Nets
24V: C27.2 C29.1 R6.2 U4.7(VOUT)
37V: C28.1 R5.1 R7.1 U4.1(VIN)  [project net CI1]
GND: C28.2 C29.2 C30.1 R8.1 R9.1 U4.4(GND) U4.8(EP)  [project net CO2]
NetC27_1: C27.1 R6.1 R8.2 U4.6(FB)
NetC30_2: C30.2 U4.5(SS)
NetR5_2: R5.2 U4.2(RON)
NetR7_2: R7.2 R9.2 U4.3(EN)

### Library data of the parts
C27 = 0.022uF C0805C223K5RACTU: KEMET - C0805C223K5RACTU - CAP, MLCC, X7R, 22NF, 50V, 0805; Dielectric Material: Ceramic; Tolerance: 10%; Supplier 1: Digi-Key; Supplier Part Number 1: 399-1163-1-ND; Manufacturer 1: KEMET; Manufacturer Part Number 1: C0805C223K5RACTU; Stock 1: 516153; Pricing 1: 1=0,10000, 10=0,06000, 100=0,02670, 500=0,01906, 1000=0,01497 (USD); RoHS: Yes; Mount: Surface Mount; Case/Package: 0805; Min Operating Temperature: -55°C; Max Operating Temperature: 125°C; Packaging: Tape and Reel; Capacitance: 22nF; Dielectric: X7R; Voltage Rating (DC): 50V; Voltage: 50V; Length: 2mm; Height: 0.78mm; Depth: 1.25mm; Radiation Hardening: No; ComponentLink1URL: https://datasheet.ciiva.com/18193/getdatasheetpartid-385695-18193669.pdf?src-supplier=Verical; ComponentLink1Description: https://datasheet.ciiva.com/18193/getdatasheetpartid-385695-18193669.pdf?src-supplier=Verical
C28 = GRT31CR61H106ME01L: as C5 on sheet rsx_low_power_board; Supplier 1: Digi-Key; Supplier Part Number 1: 490-12457-1-ND; Manufacturer Part Number 1: GRT31CR61H106ME01L; Stock 1: 8159; Pricing 1: 1=0,50000, 10=0,34900, 100=0,20920, 500=0,15690, 1000=0,13249 (USD); RoHS: Yes; Mount: Surface Mount; Case/Package: 1206; Case Code (Metric): 3216; Case Code (Imperial): 1206; Min Operating Temperature: -55°C; Max Operating Temperature: 85°C; Packaging: Tape and Reel; Capacitance: 10uF; Voltage Rating: 50V; Length: 0.126inch; Width: 0.063inch; Thickness: 0.071inch; Ratings: AEC-Q200; ComponentLink1URL: http://search.murata.co.jp/Ceramy/image/img/A01X/G101/ENG/GRT31CR61H106ME01-01.pdf?src-supplier=Digi-Key; ComponentLink1Description: http://search.murata.co.jp/Ceramy/image/img/A01X/G101/ENG/GRT31CR61H106ME01-01.pdf?src-supplier=Digi-Key; Category: Capacitor
C29 = 33uF UFW1H330MDD1TD: CAP ALUM 33UF 20% 50V RADIAL; Manufacturer 1: Nichicon; Ripple Current: 120mA; Life (Hours): 2000Hour; Supplier 1: Digi-Key; Supplier Part Number 1: 493-11010-1-ND; Manufacturer Part Number 1: UFW1H330MDD1TD; Stock 1: 4144; Pricing 1: 1=0,23000, 10=0,16000, 100=0,09070, 500=0,06404, 1000=0,05603 (USD); RoHS: Yes; Mount: Through Hole; Case/Package: Radial; Min Operating Temperature: -40°C; Max Operating Temperature: 85°C; Package Quantity: 1; Packaging: Tape and Reel; Capacitance: 33uF; Tolerance: 20%; Voltage Rating: 50V; Lead Pitch: 0.079inch; Height - Seated (Max): 0.492inch; ComponentLink1URL: http://nichicon-us.com/english/products/pdfs/e-ufw.pdf?src-supplier=Digi-Key; ComponentLink1Description: http://nichicon-us.com/english/products/pdfs/e-ufw.pdf?src-supplier=Digi-Key; ComponentLink2URL: http://nichicon-us.com/english/products/pdfs/e-mi_tape.pdf?src-supplier=Digi-Key; ComponentLink2Description: http://nichicon-us.com/english/products/pdfs/e-mi_tape.pdf?src-supplier=Digi-Key
C30 = 4700pF 0805: KEMET - C0805C472K5RACTU - CERAMIC CAPACITOR 4700PF, 50V, X7R, 10%, 0805; Capacitance: 4.7nF; Supplier 1: Digi-Key; Supplier Part Number 1: 399-1155-1-ND; Manufacturer 1: KEMET; Manufacturer Part Number 1: C0805C472K5RACTU; Stock 1: 374666; Pricing 1: 1=0,10000, 10=0,06800, 100=0,03040, 500=0,02172, 1000=0,01706 (USD); RoHS: Yes; Mount: Surface Mount; Case/Package: 0805; Number of Pins: 2; Weight: 0.000194oz; Dielectric Material: Ceramic; Contact Plating: Tin,Matte; Case Code (Imperial): 0805; Case Code (Metric): 2012; Min Operating Temperature: -55°C; Max Operating Temperature: 125°C; Tolerance: 10%; Packaging: Tape and Reel; Dielectric: X7R; Voltage Rating (DC): 50V; Package Quantity: 1; Voltage Rating: 50V; Termination: SMD/SMT; Voltage: 50V; Length: 2mm; Height: 0.78mm; Depth: 1.25mm; Width: 0.049inch; Thickness: 0.035inch; Radiation Hardening: No; REACH SVHC: No SVHC; ComponentLink1URL: https://datasheet.ciiva.com/6074/kem-c1002-x7r-smd-6074679.pdf?src-supplier=Farnell; ComponentLink1Description: https://datasheet.ciiva.com/6074/kem-c1002-x7r-smd-6074679.pdf?src-supplier=Farnell; ComponentLink2URL: https://datasheet.ciiva.com/28682/1851736-28682318.pdf?src-supplier=Element14; ComponentLink2Description: https://datasheet.ciiva.com/28682/1851736-28682318.pdf?src-supplier=Element14
R5 = RG2012P-4993-B-T5: RES SMD 499K OHM 0.1% 1/8W 0805; Manufacturer 1: Susumu; Resistance: 499kR; Power Rating: 125mW; Voltage Rating: 150V; Temperature Coefficient: 25ppm/°C; Supplier 1: Digi-Key; Supplier Part Number 1: RG20P499KBCT-ND; Manufacturer Part Number 1: RG2012P-4993-B-T5; Stock 1: 27646; Pricing 1: 1=0,41000, 10=0,31800, 100=0,13360, 1000=0,07374, 2500=0,06913 (USD); RoHS: Yes; Case/Package: 0805; Weight: 0.000194oz; Case Code (Imperial): 0805; Case Code (Metric): 2012; Min Operating Temperature: -55°C; Max Operating Temperature: 155°C; Packaging: Tape and Reel; Tolerance: 0.1%; Termination: SMD/SMT; Composition: Thin Film; Voltage Rating (DC): 150V; Length: 2mm; Height: 0.4mm; Width: 1.2mm; Lead Free: Lead Free; ComponentLink1URL: https://datasheet.ciiva.com/5624/rg-rm-rgh-datasheet-5624071.pdf?src-supplier=Mouser; ComponentLink1Description: https://datasheet.ciiva.com/5624/rg-rm-rgh-datasheet-5624071.pdf?src-supplier=Mouser
R6 = ERA6AEB3402V: RES SMD 34K OHM 0.1% 1/8W 0805; Manufacturer 1: Panasonic; Resistance: 34kR; Temperature Coefficient: 25ppm/°C; Max Power Dissipation: 125mW; Voltage Rating: 200V; Voltage Rating (DC): 100V; Supplier 1: Digi-Key; Supplier Part Number 1: P34KDACT-ND; Manufacturer Part Number 1: ERA6AEB3402V; Stock 1: 7057; Pricing 1: 1=0,36000, 10=0,30200, 100=0,11820, 1000=0,04948, 2500=0,04536 (USD); RoHS: Yes; Mount: Surface Mount; Case/Package: 0805; Number of Pins: 2; Case Code (Imperial): 0805; Case Code (Metric): 2012; Contact Plating: Tin; Min Operating Temperature: -55°C; Max Operating Temperature: 155°C; Tolerance: 0.1%; Packaging: Tape and Reel; Composition: Metal Film,Thin Film; Number of Terminations: 2; Features: Automotive AEC-Q200; Power Rating: 125mW; Package Quantity: 5000; Termination: SMD/SMT; Military Standard: Not; Length: 2mm; Height: 0.5mm; Width: 1.25mm; Depth: 1.25mm; Radiation Hardening: No; Lead Free: Lead Free; REACH SVHC: No SVHC; ComponentLink1URL: https://datasheet.ciiva.com/11815/0900766b80eb1d8c-11815791.pdf?src-supplier=RSComponents; ComponentLink1Description: https://datasheet.ciiva.com/11815/0900766b80eb1d8c-11815791.pdf?src-supplier=RSComponents; ComponentLink2URL: https://datasheet.ciiva.com/41450/001181326-da-01-en-widerstand-era-0805-34k0-0-1-5000st-41450489.pdf?src-supplier=Conrad; ComponentLink2Description: https://datasheet.ciiva.com/41450/001181326-da-01-en-widerstand-era-0805-34k0-0-1-5000st-41450489.pdf?src-supplier=Conrad; ComponentLink3URL: https://datasheet.ciiva.com/9190/aoa0000ce26-9190487.pdf?src-supplier=Avnet; ComponentLink3Description: https://datasheet.ciiva.com/9190/aoa0000ce26-9190487.pdf?src-supplier=Avnet; ComponentLink4URL: https://datasheet.ciiva.com/17210/aoa0000ce26-17210191.pdf?src-supplier=Avnet+Europe; ComponentLink4Description: https://datasheet.ciiva.com/17210/aoa0000ce26-17210191.pdf?src-supplier=Avnet+Europe; ComponentLink5URL: https://datasheet.ciiva.com/22705/485442-22705221.pdf?src-supplier=Element14; ComponentLink5Description: https://datasheet.ciiva.com/22705/485442-22705221.pdf?src-supplier=Element14; ComponentLink6URL: https://datasheet.ciiva.com/6052/485442-6052790.pdf?src-supplier=Farnell; ComponentLink6Description: https://datasheet.ciiva.com/6052/485442-6052790.pdf?src-supplier=Farnell; ComponentLink7URL: https://datasheet.ciiva.com/7870/485442-7870667.pdf?src-supplier=Element14; ComponentLink7Description: https://datasheet.ciiva.com/7870/485442-7870667.pdf?src-supplier=Element14; ComponentLink8URL: https://datasheet.ciiva.com/7870/485442-7870668.pdf?src-supplier=Element14; ComponentLink8Description: https://datasheet.ciiva.com/7870/485442-7870668.pdf?src-supplier=Element14
R7-R9 = ERA-6AEB1181V: RES SMD 1.18K OHM 0.1% 1/8W 0805; Manufacturer 1: Panasonic; Resistance: 1.18kR; Power Rating: 125mW; Voltage Rating: 100V; Temperature Coefficient: 25ppm/°C; Supplier 1: Digi-Key; Supplier Part Number 1: P1.18KDACT-ND; Manufacturer Part Number 1: ERA-6AEB1181V; Stock 1: 9011; Pricing 1: 1=0,36000, 10=0,30200, 100=0,11820, 1000=0,04948, 2500=0,04536 (USD); RoHS: Yes; Mount: Surface Mount; Case/Package: 0805; Number of Pins: 2; Case Code (Imperial): 0805; Case Code (Metric): 2012; Contact Plating: Tin; Min Operating Temperature: -55°C; Max Operating Temperature: 155°C; Tolerance: 0.1%; Packaging: Tape and Reel; Composition: Metal Film,Thin Film; Package Quantity: 1; Termination: SMD/SMT; Number of Terminations: 2; Max Power Dissipation: 125mW; Voltage Rating (DC): 100V; Features: Automotive AEC-Q200; Length: 2mm; Height: 0.5mm; Width: 1.25mm; Depth: 1.25mm; Radiation Hardening: No; Lead Free: Lead Free; ComponentLink1URL: https://datasheet.ciiva.com/11811/0900766b80eb1d8c-11811515.pdf?src-supplier=RSComponents; ComponentLink1Description: https://datasheet.ciiva.com/11811/0900766b80eb1d8c-11811515.pdf?src-supplier=RSComponents; ComponentLink2URL: https://datasheet.ciiva.com/26335/459360-da-01-en-widerstand-0805-era-26335818.pdf?src-supplier=Conrad; ComponentLink2Description: https://datasheet.ciiva.com/26335/459360-da-01-en-widerstand-0805-era-26335818.pdf?src-supplier=Conrad; ComponentLink3URL: https://datasheet.ciiva.com/7911/485442-7911589.pdf?src-supplier=Element14; ComponentLink3Description: https://datasheet.ciiva.com/7911/485442-7911589.pdf?src-supplier=Element14; ComponentLink4URL: https://datasheet.ciiva.com/7911/485442-7911590.pdf?src-supplier=Element14; ComponentLink4Description: https://datasheet.ciiva.com/7911/485442-7911590.pdf?src-supplier=Element14; ComponentLink5URL: https://datasheet.ciiva.com/5870/485442-5870600.pdf?src-supplier=Farnell; ComponentLink5Description: https://datasheet.ciiva.com/5870/485442-5870600.pdf?src-supplier=Farnell; ComponentLink6URL: https://datasheet.ciiva.com/5870/485442-5870601.pdf?src-supplier=Farnell; ComponentLink6Description: https://datasheet.ciiva.com/5870/485442-5870601.pdf?src-supplier=Farnell; ComponentLink7URL: https://datasheet.ciiva.com/9198/aoa0000ce26-9198586.pdf?src-supplier=Avnet; ComponentLink7Description: https://datasheet.ciiva.com/9198/aoa0000ce26-9198586.pdf?src-supplier=Avnet; ComponentLink8URL: https://datasheet.ciiva.com/5870/485442-5870603.pdf?src-supplier=Farnell; ComponentLink8Description: https://datasheet.ciiva.com/5870/485442-5870603.pdf?src-supplier=Farnell
U4 = LMZ14203HTZX/NOPB: IC BUCK SYNC ADJ 3A TO-PMOD-7; Manufacturer 1: TI National Semiconductor; Number of Outputs: 1; Output Voltage: 5V; Max Input Voltage: 42V; Min Input Voltage: 6V; Efficiency: 97%; Voltage - Output 1: 30V; Isolation: Non-Isolated; Max Power Dissipation: 90W; Switching Frequency: 1MHz; Supplier 1: Digi-Key; Supplier Part Number 1: 296-43602-1-ND; Manufacturer Part Number 1: LMZ14203HTZX/NOPB; Stock 1: 794; Pricing 1: 1=12,71000, 5=12,61600, 10=12,52000, 25=12,32720, 50=11,94180, 100=10,78620, 250=10,59356 (USD); RoHS: Yes; Mount: Surface Mount; Number of Pins: 7; Contact Plating: Tin,Matte; Min Operating Temperature: -40°C; Max Operating Temperature: 125°C; Output Current: 3A; Packaging: Tape and Reel; Package Quantity: 500; Max Output Current: 3A; Features: UVLO; Length: 0.4inch; Height: 0.18inch; Width: 0.54inch; Depth: 9.85mm; Lead Free: Lead Free; ComponentLink1URL: http://components.arrow.com/part/dataview/56275422S8868331N1317?src-supplier=Arrow; ComponentLink1Description: http://components.arrow.com/part/dataview/56275422S8868331N1317?src-supplier=Arrow; ComponentLink2URL: http://components.arrow.com/part/dataview/0323_03165962?src-supplier=Arrow+Europe; ComponentLink2Description: http://components.arrow.com/part/dataview/0323_03165962?src-supplier=Arrow+Europe; ComponentLink3URL: http://www.ti.com/general/docs/lit/getliterature.tsp?genericPartNumber=LMZ14203H&&fileType=pdf&src-supplier=Avnet; ComponentLink3Description: http://www.ti.com/general/docs/lit/getliterature.tsp?genericPartNumber=LMZ14203H&&fileType=pdf&src-supplier=Avnet; ComponentLink4URL: http://www.ti.com/general/docs/lit/getliterature.tsp?genericPartNumber=LMZ14203H&amp;&amp;fileType=pdf&src-supplier=Avnet+Asia; ComponentLink4Description: http://www.ti.com/general/docs/lit/getliterature.tsp?genericPartNumber=LMZ14203H&amp;&amp;fileType=pdf&src-supplier=Avnet+Asia; ComponentLink5URL: http://www.ti.com/lit/pdf/snaa214?src-supplier=Digi-Key; ComponentLink5Description: http://www.ti.com/lit/pdf/snaa214?src-supplier=Digi-Key; ComponentLink6URL: http://www.ti.com/lit/ds/symlink/lmz14203h.pdf?src-supplier=Digi-Key; ComponentLink6Description: http://www.ti.com/lit/ds/symlink/lmz14203h.pdf?src-supplier=Digi-Key; ComponentLink7URL: http://www.ti.com/lit/gpn/lmz14203h?src-supplier=Mouser; ComponentLink7Description: http://www.ti.com/lit/gpn/lmz14203h?src-supplier=Mouser

## Sheet rsx_low_power_board In Going Connectors.SchDoc
size A4
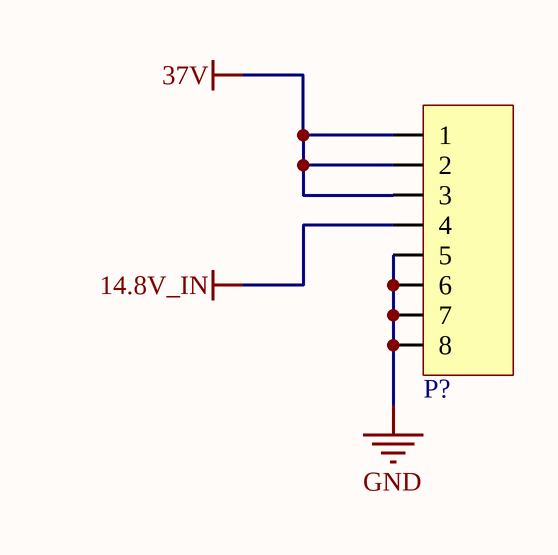
[diagram p4: rsx_low_power_board In Going Connectors.SchDoc]

### Parts
P?  Mini-Fit Jr 8 Pos  [Molex Mini-Fit Jr 0039281083]  (value not drawn)

### Nets
14.8V_IN: P?.4
37V: P?.1 P?.2 P?.3  [project net CI1]
GND: P?.5 P?.6 P?.7 P?.8  [project net CO2]

### Library data of the parts
P? = Molex Mini-Fit Jr 8pos Vert